# Altium schematic sheet motor_sch.SchDoc
size A4
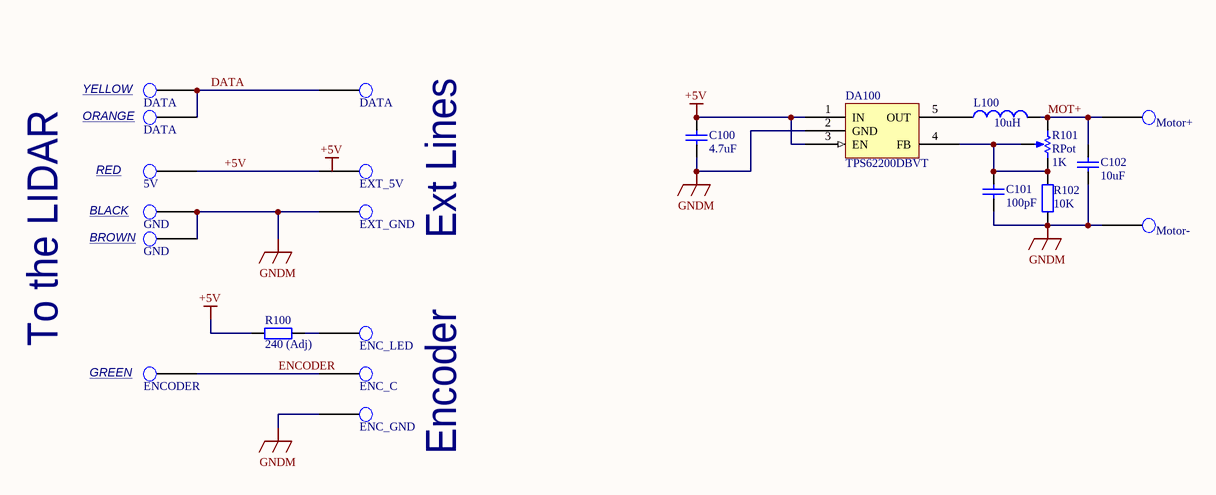
[diagram p0: motor_sch.SchDoc]

## Parts
C100  4.7uF  [CAPC2012X135N]
C101  100pF  [CAPC1608X90N]
C102  10uF  [CAPC3216X100N]
DA100  TPS62200DBVT  [SOT23-5]
L100  value 10uH  [INDC3216]  (hidden comment: Inductor)
P101  DATA  [Ext_pad]
P102  DATA  [Ext_pad]
P103  DATA  [Ext_pad]
P104  ENC_LED  [Ext_pad]
P105  ENC_C  [Ext_pad]
P106  ENC_GND  [Ext_pad]
P107  ENCODER  [Ext_pad]
P109  5V  [Ext_pad]
P110  EXT_5V  [Ext_pad]
P111  EXT_GND  [Ext_pad]
P112  Motor+  [Ext_hole]
P113  Motor-  [Ext_hole]
P114  GND  [Ext_pad]
P115  GND  [Ext_pad]
R100  240 (Adj)  [RESC1608X55N]
R101  RPot  value 1K  [VR5]
R102  10K  [RESC1608X55N]

## Nets
+5V: C100.2 DA100.1(IN) DA100.3(EN) P109.1(Pad) P110.1(Pad) R100.2
GNDM: C100.1 C101.1 C102.1 DA100.2(GND) P106.1(Pad) P111.1(Pad) P113.1(Pad) P114.1(Pad) P115.1(Pad) R102.1
DATA: P101.1(Pad) P102.1(Pad) P103.1(Pad)
ENCODER: P105.1(Pad) P107.1(Pad)
MOT+: C102.2 L100.2 P112.1(Pad) R101.1(TOP)
NetC101_2: C101.2 DA100.4(FB) R101.2(BOT) R101.3(TAP) R102.2
NetDA100_5: DA100.5(OUT) L100.1
NetP104_1: P104.1(Pad) R100.1

## Notes on the sheet
- YELLOW
- ORANGE
- RED
- BLACK
- BROWN
- Ext Lines
- To the LIDAR
- (near P107) GREEN
- Encoder
- Labels drawn without touching a wire or pin: +5V

## Library data of the parts
C100-C102 = CC0805: Chip capacitor; Voltage: 25V; Series: X7R
  C100: Value: 4.7uF
  C101: Value: 100pF
  C102: Value: 10uF
DA100 = TPS62200: DC-DC step-down
L100 = Inductor: Code_IEC: 1005; Published: 8-Jun-2000; LatestRevisionDate: 29-May-2009; LatestRevisionNote: IPC-7351 Footprint Added.; PackageReference: 0402-A; Publisher: Altium Limited; PackageDescription: Chip Inductor; Code_JEITA: 0402
P101-P107 P109-P111 P114 P115 = Ext Pad: Pad for wire
P112 P113 = Hole Pad
R100 R102 = RC0805: Chip resistor; Tolerance: 5%
  R100: Value: 240 (Adj)
  R102: Value: 10K
R101 = RPot: Potentiometer; Sim Note: Enter the Resistance value and the set point into parameter fields.; Set Position: 0.5; Published: 8-Jun-2000; LatestRevisionDate: 17-Jul-2002; LatestRevisionNote: Re-released for DXP Platform.; PackageReference: VR5; Publisher: Altium Limited; PackageDescription: Variable Resistor, Thru-Hole; 3 Leads